# EAGLE design 0122-lion-charger (EAGLE 9.6.2)
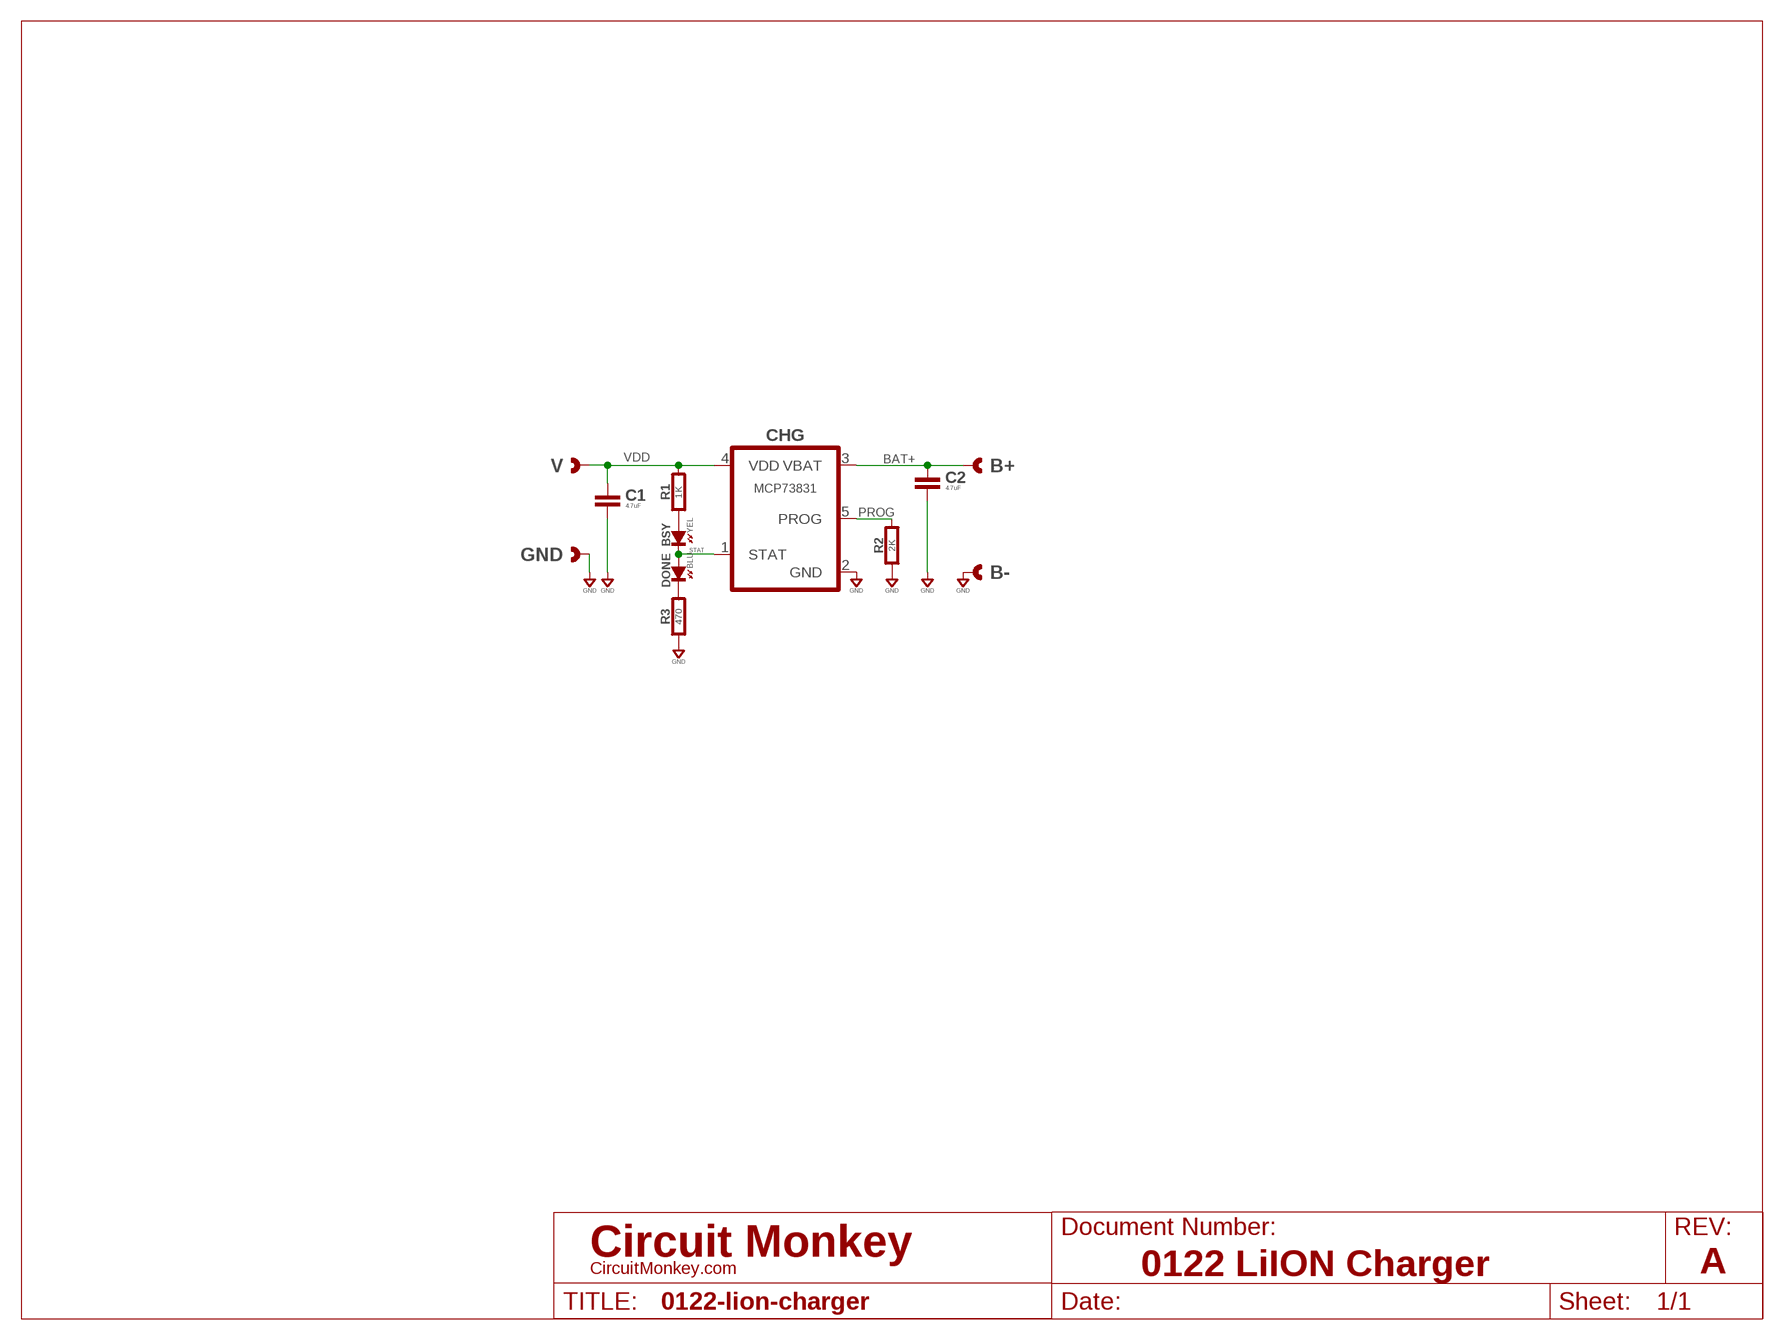
[diagram p0: schematic, sheet 1]
U$1 (LETTER_L-CIRCUITMONKEY): DOCUMENT_NUMBER: 0122 LiION Charger; REV: A

## Parts
B+  CAST-01X12.00MM  [CAST01-2.00MM]
B-  CAST-01X12.00MM  [CAST01-2.00MM]
BSY  YEL  SMT0603  [SMD_0603]
C1  4.7uF  CAPACITOR0603  [0603-CAP]
C2  4.7uF  CAPACITOR0603  [0603-CAP]
CHG  MCP73831  MCP73831/2-SOT23-5  [SOT-23-5]
DONE  BLU  SMT0603  [SMD_0603]
GND  CAST-01X12.00MM  [CAST01-2.00MM]
R1  1K  RESISTOR0603  [0603-RES]
R2  2K  RESISTOR0603  [0603-RES]
R3  470  RESISTOR0603  [0603-RES]
V  CAST-01X12.00MM  [CAST01-2.00MM]

## Nets
BAT+: B+.1 B+.P$1 B+.P$2 C2.1 CHG.3(VBAT)
GND: B-.1 B-.P$1 B-.P$2 C1.2 C2.2 CHG.2(GND) GND.1 GND.P$1 GND.P$2 R2.1 R3.1
N$2: BSY.A R1.1
N$3: DONE.K(C) R3.2
PROG: CHG.5(PROG) R2.2
STAT: BSY.K(C) CHG.1(STAT) DONE.A
VDD: C1.1 CHG.4(VDD) R1.2 V.1 V.P$1 V.P$2

## Library data of the parts
B+ B- GND V = con-headers:CAST-01X1: Castelated Edge Hole Pad
BSY DONE = led:SMT: LED SMT
C1 C2 = rlc:CAPACITOR: Capacitor
CHG = co-microchip:MCP73831/2: Li-Ion Charger; MFR: Microchip; MPN: MCP73831-2ACI/OT
R1-R3 = rlc:RESISTOR: Resistor

## Board
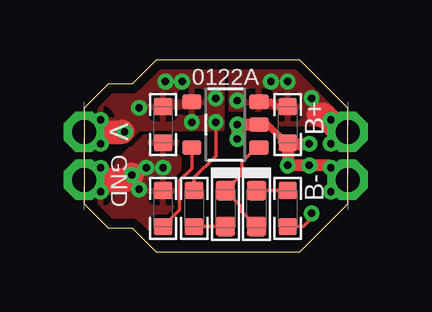
[diagram p1: board, top side]
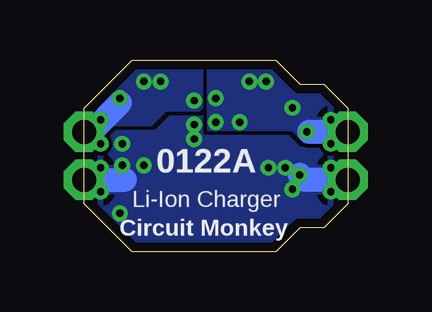
[diagram p2: board, bottom side, seen from below]

Size 11 x 8 mm. Coordinates in mm from the lower left corner, seen from the top.
Outline: 3,0 9,0 11,2 11,6 9,8 3,8 2,7 1,7 0,6 0,2 1,1 2,1 3,0
Copper layers (1*16): Top 0.0356mm / dielectric 1.5011mm / Bottom 0.0356mm
Design rules "OSH-CircuitMonkey *": minimum track width 6mil, minimum drill 12mil, track to track 6mil, track to pad 6mil, pad to pad 6mil, via to via 6mil, smd to smd 6mil, copper to edge 15mil, drill to drill 6mil, minimum pad ring 7mil, minimum via ring 7mil, stop-mask expansion 3mil, vias tented up to drill 13mil, thermal gap 10mil

### Footprints (pad centres in the part's own frame; a part is rotated, then mirrored left to right if it is on the bottom)
CAST01-2.00MM = drill 1 pad 1.7 octagon: 1 0,0 | drill 0.305: P$1 -0.7,0.5; P$2 -0.7,-0.5
SMD_0603 = smd 0.8 x 0.8: A 0.75,0; K -0.75,0
0603-CAP = smd 0.711 x 0.762: 1 -0.752,0; 2 0.752,0
SOT-23-5 = smd 0.6 x 0.8: 1 -0.95,-1.4; 2 0,-1.4; 3 0.95,-1.4; 4 0.95,1.4; 5 -0.95,1.4
0603-RES = smd 0.711 x 0.762: 1 -0.752,0; 2 0.752,0

### Placement (x,y rotation side)
B+  11,5 0 top
B-  11,3 0 top
BSY  5.9,1.8 270 top
C1  3.3,5.3 270 top
C2  8.5,5.3 270 top
CHG  5.9,5.3 90 top
DONE  7.2,1.8 270 top
GND  0,3 180 top
R1  4.6,1.8 90 top
R2  3.3,1.8 270 top
R3  8.5,1.8 90 top
V  0,5 180 top

### Tracks (layer width: path | path; a pad name or v marks a point on that pad's centre or on a via)
BAT+  (via drill 0.3)
  Top 0.152: 10.8,5 B+.P$1 | B+.1 10.8,5 | 10.8,5 B+.P$2
  Top 0.3: CHG.3 7.8,6.25 8,6.05 C2.1
  Top 1: B+.1 10.7,5 10,5.7 9.8,5.7
  Bottom 1: B+.1 10.7,5 9.5,6.2
  other vias: 8.5,7.1 6.4,6.3 7.8,7.1 9.5,6.4
  pour Bottom (rank 4): 11,8 6,8 6,6.1 6.2,5.9 7.6,5.9 8.2,5.3 10.7,5.3 11,5.6
  pour Top: 6.1,8 9,8 11,6 11,4.4 10.7,4.4 9.8,5.3 8.2,5.3 7.6,5.9 6.1,5.9
GND  (via drill 0.3)
  Top 0.152: R3.1 9.15,1.05 9.5,1.4 v9.5,1.6
  Top 0.3: CHG.2 7.67,5.3 8.42,4.55 C2.2
  Top 0.5: v9.4,4.5 8.55,4.5 C2.2 v8.5,3.6 v9.4,3.6 10.2,3.6 10.8,3 B-.1 | v6.4,4.7 v6.4,5.3 CHG.2
  Top 1: GND.1 1.8,3 v2,3.2
  Bottom 0.152: 10.8,3 B-.P$1 | B-.1 10.8,3 | 10.8,3 B-.P$2 | 0.2,3 GND.P$2 | GND.1 0.2,3 | 0.2,3 GND.P$1
  Bottom 1: B-.1 9.3,3 | GND.1 1.8,3 v2,3.2
  other vias: 2.3,2.6 3.3,3.5 2.6,3.5
  pour Bottom (rank 5): 0,0 0,5.7 9,5.7 11,3.7 11,0
  pour Top (rank 5): 0,0 4,0 4,5 2.6,5 1.1,3.5 0,3.5
N$2
  Top 0.152: BSY.A R1.1
N$3
  Top 0.152: DONE.K R3.2
PROG
  Top 0.152: R2.2 3.99,1.74 3.99,2.96 4.5,3.47 CHG.5
STAT
  Top 0.152: DONE.A 6.6,1.65 6.6,1.85 BSY.K 6.6,3.25 6.6,3.75 7.2,4.35 CHG.1
VDD  (via drill 0.3)
  Top 0.152: R1.2 4.6,3.1 5.5,4 v5.5,5.4
  Top 1: V.1 1.6,5
  Bottom 0.152: 0.2,5 V.P$2 | V.1 0.2,5 | 0.2,5 V.P$1
  Bottom 1: V.1 1.6,5
  other vias: 3.4,7.1 4.1,7.1 5.5,6.4 2.3,6 4.5,5.4 1.7,5
  pour Bottom (rank 2): 0,8 5.8,8 5.8,5.1 2.3,5.1 1.8,4.6 0,4.6
  pour Top (rank 2): 0,8 5.8,8 5.8,5.1 2.3,5.1 1.8,4.6 0,4.6

### Text on the board
tPlace: 0122A
bPlace: 0122A | Li-Ion Charger | Circuit Monkey